# EAGLE design denmark (EAGLE 9.6.1)

## Sheet 1 of 2
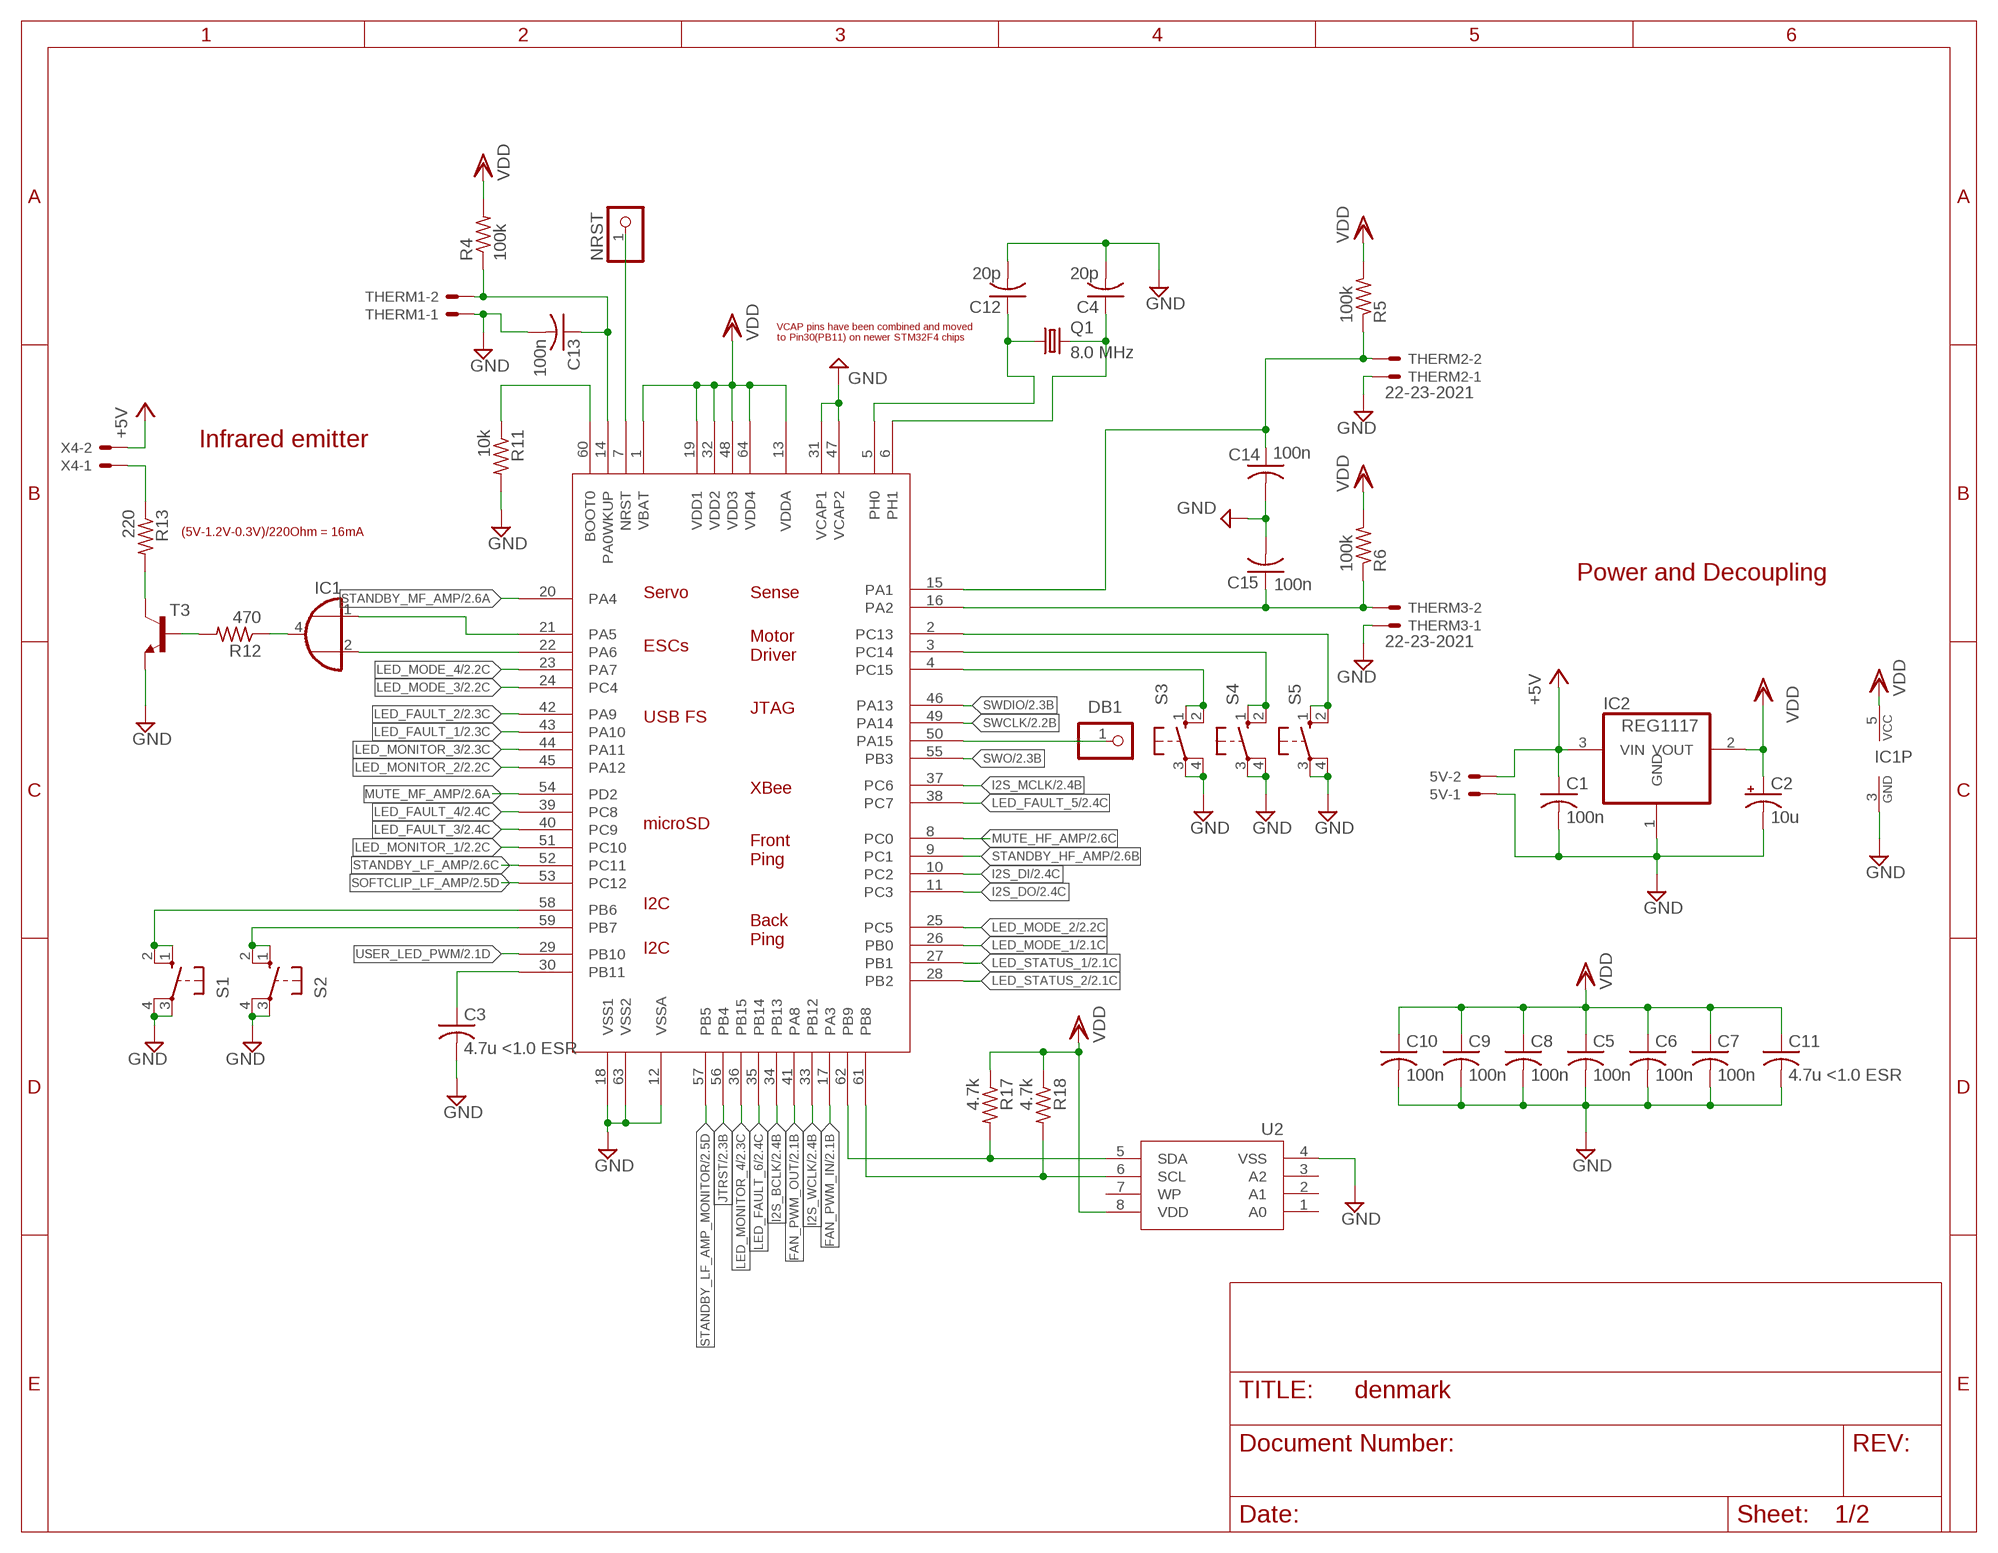
[diagram p0: schematic, sheet 1]

### Parts
5V  22-23-2021  [22-23-2021]
C1  100n  C-USC0805  [C0805]
C2  10u  CPOL-USE3.5-8  [E3,5-8]
C3  4.7u <1.0 ESR  C-USC1206  [C1206]
C4  20p  C-USC0603K  [C0603K]
C5  100n  C-USC0603K  [C0603K]
C6  100n  C-USC0603K  [C0603K]
C7  100n  C-USC0603K  [C0603K]
C8  100n  C-USC0603K  [C0603K]
C9  100n  C-USC0603K  [C0603K]
C10  100n  C-USC0603K  [C0603K]
C11  4.7u <1.0 ESR  C-USC1206  [C1206]
C12  20p  C-USC0603K  [C0603K]
C13  100n  C-USC0603K  [C0603K]
C14  100n  C-USC0603K  [C0603K]
C15  100n  C-USC0603K  [C0603K]
DB1  PINHD-1X1  [1X01]
IC1  74AHC1G32DBV  [SOT23-5]
IC2  REG1117  [SOT223]
NRST  PINHD-1X1  [1X01]
Q1  8.0 MHz  CRYSTALHC49U-V  [HC49U-V]
R4  100k  R-US_R0603  [R0603]
R5  100k  R-US_R0603  [R0603]
R6  100k  R-US_R0603  [R0603]
R11  10k  R-US_R0603  [R0603]
R12  470  R-US_R0603  [R0603]
R13  220  R-US_R0603  [R0603]
R17  4.7k  R-US_R0603  [R0603]
R18  4.7k  R-US_R0603  [R0603]
S1  10-XX  [B3F-10XX]
S2  10-XX  [B3F-10XX]
S3  10-XX  [B3F-10XX]
S4  10-XX  [B3F-10XX]
S5  10-XX  [B3F-10XX]
T3  MMBT3904LT1-NPN-SOT23-BEC  [SOT23-BEC]
THERM1  22-23-2021  [22-23-2021]
THERM2  22-23-2021  [22-23-2021]
THERM3  22-23-2021  [22-23-2021]
U1  STM32F4_10X10_LQFP64  [LQFP-ST-64-2]
U2  MB85RCSOIC8  [SOIC8]
X4  22-23-2021  [22-23-2021]

### Nets
+5V: 5V.2 C1.1 IC2.3(VIN) X4.2 ; also sheet 2
BUTTON1_INPUT: S1.1(S) S1.2(S1) U1.58(PB6)
BUTTON2_INPUT: S2.1(S) S2.2(S1) U1.59(PB7)
BUTTON3_INPUT: S3.1(S) S3.2(S1) U1.4(PC15)
BUTTON4_INPUT: S4.1(S) S4.2(S1) U1.3(PC14)
BUTTON5_INPUT: S5.1(S) S5.2(S1) U1.2(PC13)
FAN_PWM_IN: U1.17(PA3) ; also sheet 2
FAN_PWM_OUT: U1.41(PA8) ; also sheet 2
GND: 5V.1 C1.2 C2.- C3.2 C4.2 C5.2 C6.2 C7.2 C8.2 C9.2 C10.2 C11.2 C12.2 C13.2 C14.2 C15.2 IC1.3(GND) IC2.1(GND) R11.2 S1.3(P) S1.4(P1) S2.3(P) S2.4(P1) S3.3(P) S3.4(P1) S4.3(P) S4.4(P1) S5.3(P) S5.4(P1) T3.E THERM1.1 THERM2.1 THERM3.1 U1.12(VSSA) U1.18(VSS1) U1.31(VCAP1) U1.47(VCAP2) U1.63(VSS2) U2.4(VSS) ; also sheet 2
I2C_SCL: R18.2 U1.61(PB8) U2.6(SCL)
I2C_SDA: R17.2 U1.62(PB9) U2.5(SDA)
I2S_BCLK: U1.34(PB13) ; also sheet 2
I2S_DI: U1.10(PC2) ; also sheet 2
I2S_DO: U1.11(PC3) ; also sheet 2
I2S_MCLK: U1.37(PC6) ; also sheet 2
I2S_WCLK: U1.33(PB12) ; also sheet 2
IR_BASE: R12.2 T3.B
IR_CARRIER_OUT: IC1.2(I1) U1.22(PA6)
IR_COLLECTOR: R13.2 T3.C
IR_SIGNAL_OUT: IC1.1(I0) U1.21(PA5)
JTRST: U1.56(PB4) ; also sheet 2
LED_FAULT_1: U1.43(PA10) ; also sheet 2
LED_FAULT_2: U1.42(PA9) ; also sheet 2
LED_FAULT_3: U1.40(PC9) ; also sheet 2
LED_FAULT_4: U1.39(PC8) ; also sheet 2
LED_FAULT_5: U1.38(PC7) ; also sheet 2
LED_FAULT_6: U1.35(PB14) ; also sheet 2
LED_MODE_1: U1.26(PB0) ; also sheet 2
LED_MODE_2: U1.25(PC5) ; also sheet 2
LED_MODE_3: U1.24(PC4) ; also sheet 2
LED_MODE_4: U1.23(PA7) ; also sheet 2
LED_MONITOR_1: U1.51(PC10) ; also sheet 2
LED_MONITOR_2: U1.45(PA12) ; also sheet 2
LED_MONITOR_3: U1.44(PA11) ; also sheet 2
LED_MONITOR_4: U1.36(PB15) ; also sheet 2
LED_STATUS_1: U1.27(PB1) ; also sheet 2
LED_STATUS_2: U1.28(PB2) ; also sheet 2
MUTE_HF_AMP: U1.8(PC0) ; also sheet 2
MUTE_MF_AMP: U1.54(PD2) ; also sheet 2
N$42: C3.1 U1.30(PB11)
N$43: DB1.1 U1.50(PA15)
N$45: R11.1 U1.60(BOOT0)
N$46: NRST.1 U1.7(NRST)
N$47: IC1.4(O) R12.1
N$50: R13.1 X4.1
RCC_OSC_IN: C12.1 Q1.1 U1.5(PH0)
RCC_OSC_OUT: C4.1 Q1.2 U1.6(PH1)
SOFTCLIP_LF_AMP: U1.53(PC12) ; also sheet 2
STANDBY_HF_AMP: U1.9(PC1) ; also sheet 2
STANDBY_LF_AMP: U1.52(PC11) ; also sheet 2
STANDBY_LF_AMP_MONITOR: U1.57(PB5) ; also sheet 2
STANDBY_MF_AMP: U1.20(PA4) ; also sheet 2
SWCLK: U1.49(PA14) ; also sheet 2
SWDIO: U1.46(PA13) ; also sheet 2
SWO: U1.55(PB3) ; also sheet 2
THERM1_ANALOG_INPUT: C13.1 R4.1 THERM1.2 U1.14(PA0WKUP)
THERM2_ANALOG_INPUT: C14.1 R5.1 THERM2.2 U1.15(PA1)
THERM3_ANALOG_INPUT: C15.1 R6.1 THERM3.2 U1.16(PA2)
USER_LED_PWM: U1.29(PB10) ; also sheet 2
VDD: C2.+ C5.1 C6.1 C7.1 C8.1 C9.1 C10.1 C11.1 IC1.5(VCC) IC2.2(VOUT) R4.2 R5.2 R6.2 R17.1 R18.1 U1.1(VBAT) U1.13(VDDA) U1.19(VDD1) U1.32(VDD2) U1.48(VDD3) U1.64(VDD4) U2.8(VDD) ; also sheet 2
Unconnected: U2.1(A0) U2.2(A1) U2.3(A2) U2.7(WP)

### Notes on the sheet
- VCAP pins have been combined and moved 
  to Pin30(PB11) on newer STM32F4 chips
- Infrared emitter
- (5V-1.2V-0.3V)/220Ohm = 16mA
- Power and Decoupling

## Sheet 2 of 2: Input/Output
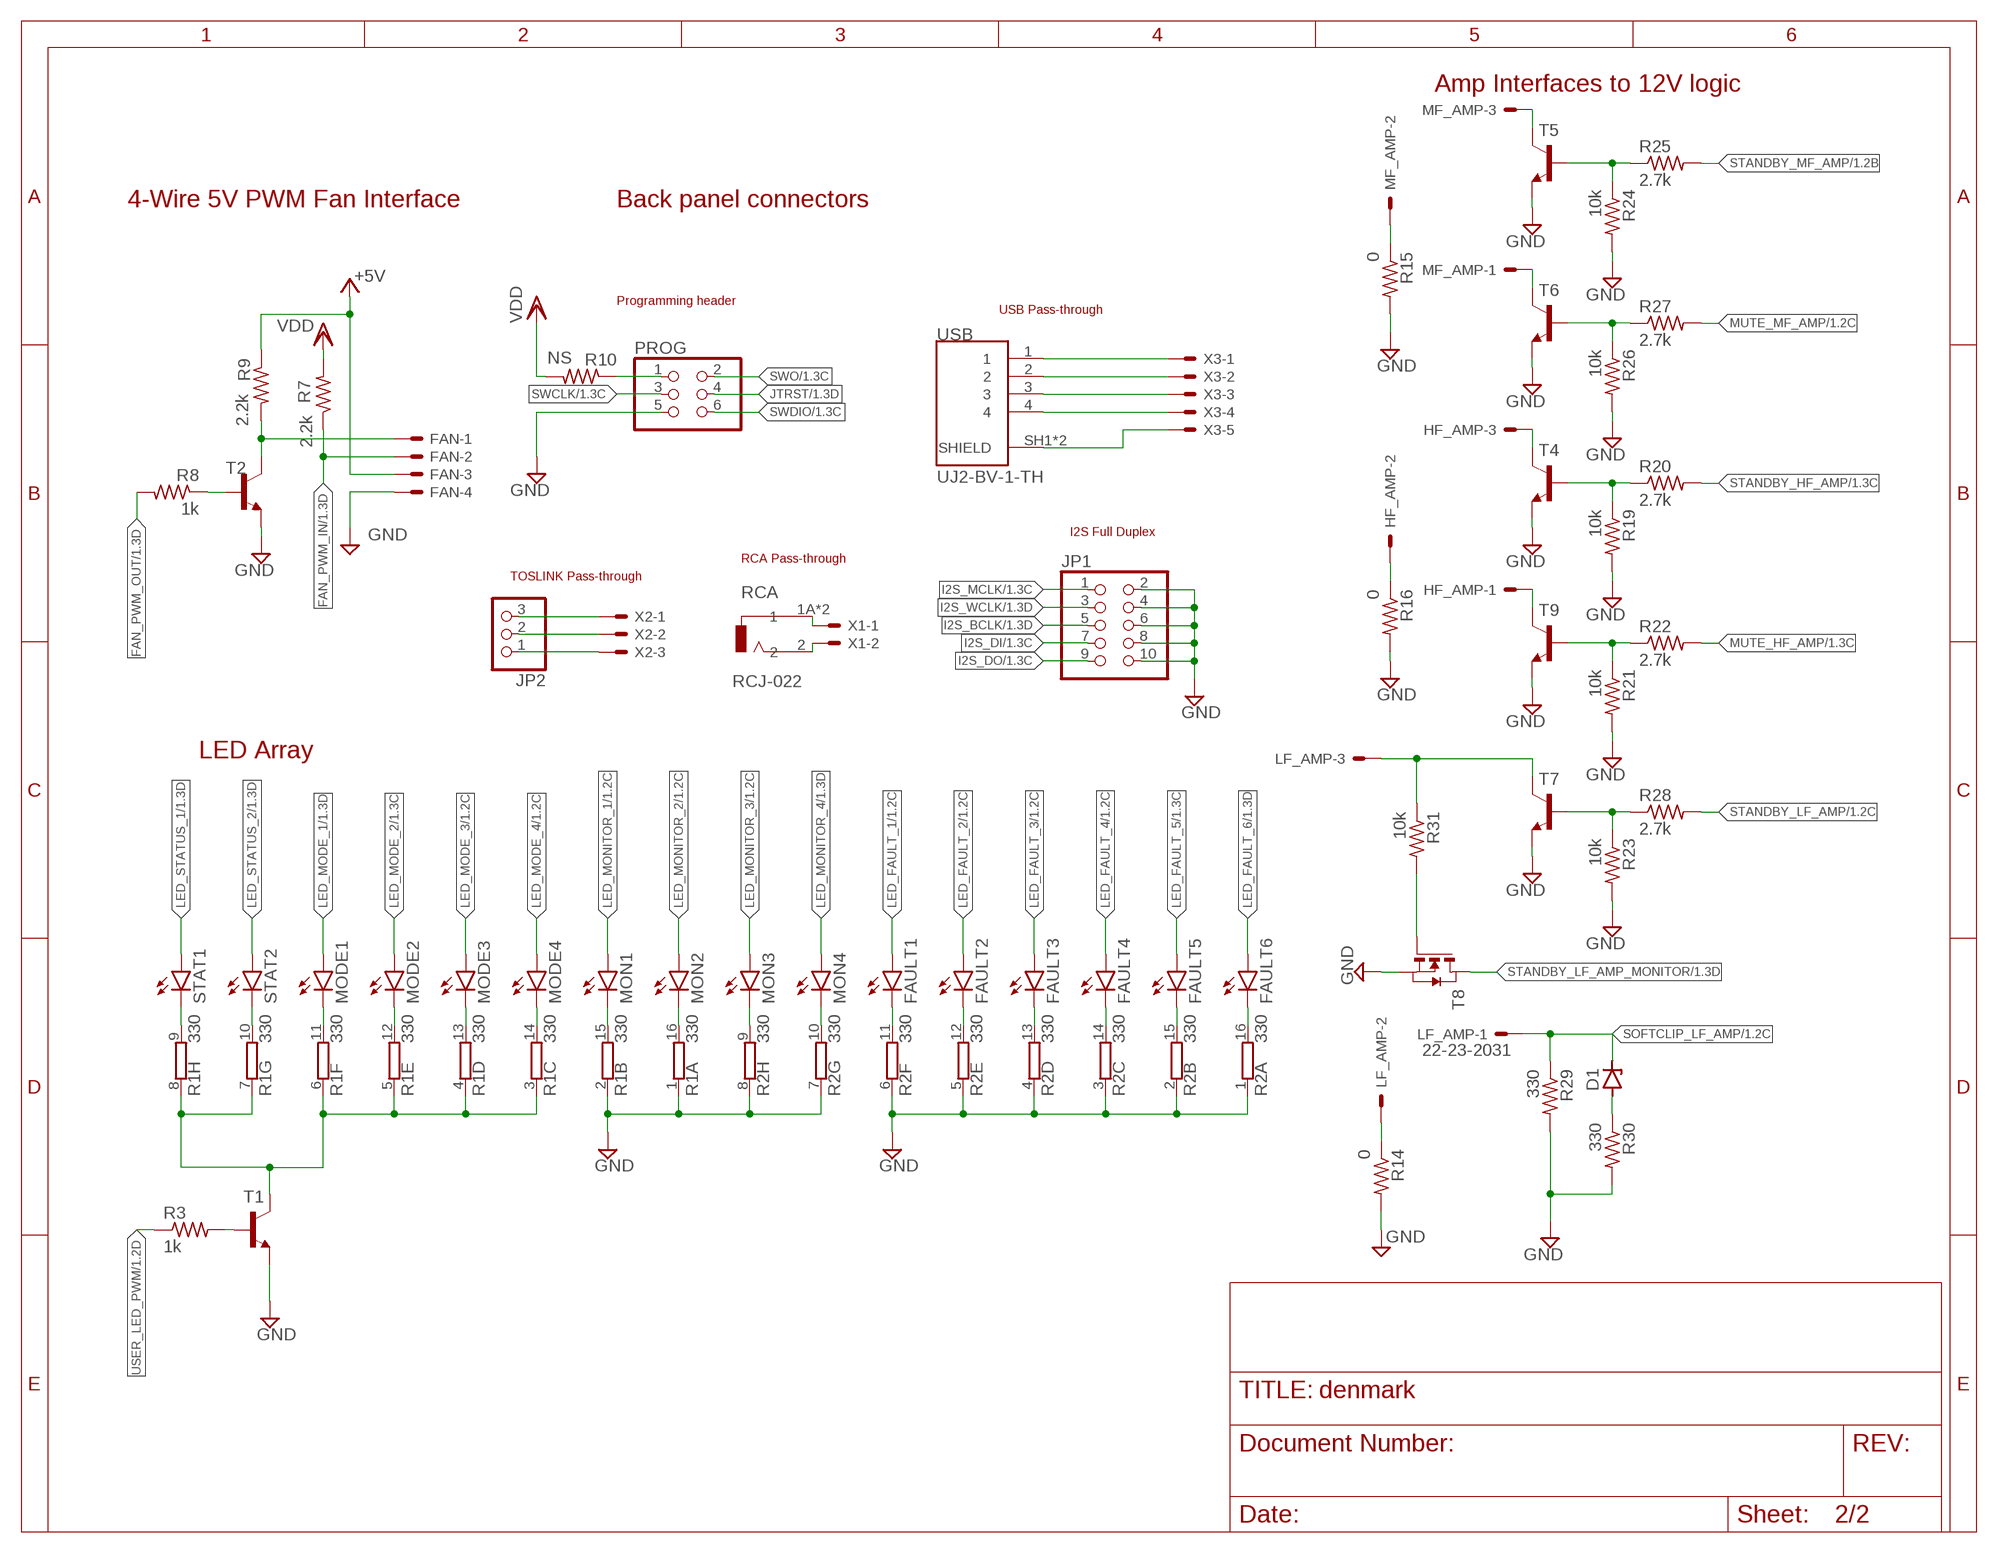
[diagram p1: schematic, sheet 2]

### Parts
D1  ZENER-DIODESOD80C  [SOD80C]
FAN  22-23-2041  [22-23-2041]
FAULT1  LEDCHIPLED_0805  [CHIPLED_0805]
FAULT2  LEDCHIPLED_0805  [CHIPLED_0805]
FAULT3  LEDCHIPLED_0805  [CHIPLED_0805]
FAULT4  LEDCHIPLED_0805  [CHIPLED_0805]
FAULT5  LEDCHIPLED_0805  [CHIPLED_0805]
FAULT6  LEDCHIPLED_0805  [CHIPLED_0805]
HF_AMP  22-23-2031  [22-23-2031]
JP1  PINHD-2X5  [2X05]
JP2  PINHD-1X3  [1X03]
LF_AMP  22-23-2031  [22-23-2031]
MF_AMP  22-23-2031  [22-23-2031]
MODE1  LEDCHIPLED_0805  [CHIPLED_0805]
MODE2  LEDCHIPLED_0805  [CHIPLED_0805]
MODE3  LEDCHIPLED_0805  [CHIPLED_0805]
MODE4  LEDCHIPLED_0805  [CHIPLED_0805]
MON1  LEDCHIPLED_0805  [CHIPLED_0805]
MON2  LEDCHIPLED_0805  [CHIPLED_0805]
MON3  LEDCHIPLED_0805  [CHIPLED_0805]
MON4  LEDCHIPLED_0805  [CHIPLED_0805]
PROG  PINHD-2X3  [2X03]
R1  330  2NBS16-8E  [SO16]
R2  330  2NBS16-8E  [SO16]
R3  1k  R-US_R0603  [R0603]
R7  2.2k  R-US_R0603  [R0603]
R8  1k  R-US_R0603  [R0603]
R9  2.2k  R-US_R0603  [R0603]
R10  NS  R-US_R0603  [R0603]
R14  0  R-US_R0603  [R0603]
R15  0  R-US_R0603  [R0603]
R16  0  R-US_R0603  [R0603]
R19  10k  R-US_R0603  [R0603]
R20  2.7k  R-US_R0603  [R0603]
R21  10k  R-US_R0603  [R0603]
R22  2.7k  R-US_R0603  [R0603]
R23  10k  R-US_R0603  [R0603]
R24  10k  R-US_R0603  [R0603]
R25  2.7k  R-US_R0603  [R0603]
R26  10k  R-US_R0603  [R0603]
R27  2.7k  R-US_R0603  [R0603]
R28  2.7k  R-US_R0603  [R0603]
R29  330  R-US_R0603  [R0603]
R30  330  R-US_R0603  [R0603]
R31  10k  R-US_R0603  [R0603]
RCA  RCJ-022  [CUI_RCJ-022]
STAT1  LEDCHIPLED_0805  [CHIPLED_0805]
STAT2  LEDCHIPLED_0805  [CHIPLED_0805]
T1  MMBT3904LT1-NPN-SOT23-BEC  [SOT23-BEC]
T2  MMBT3904LT1-NPN-SOT23-BEC  [SOT23-BEC]
T4  MMBT3904LT1-NPN-SOT23-BEC  [SOT23-BEC]
T5  MMBT3904LT1-NPN-SOT23-BEC  [SOT23-BEC]
T6  MMBT3904LT1-NPN-SOT23-BEC  [SOT23-BEC]
T7  MMBT3904LT1-NPN-SOT23-BEC  [SOT23-BEC]
T8  NMOSSOT23  [SOT-23]
T9  MMBT3904LT1-NPN-SOT23-BEC  [SOT23-BEC]
USB  UJ2-BV-1-TH  [CUI_UJ2-BV-1-TH]
X1  22-23-2021  [22-23-2021]
X2  22-23-2031  [22-23-2031]
X3  22-23-2051  [22-23-2051]

### Nets
+5V: FAN.3 R9.1 ; also sheet 1
FAN_PWM_IN: FAN.2 R7.1 ; also sheet 1
FAN_PWM_OUT: R8.2 ; also sheet 1
GND: FAN.4 JP1.2 JP1.4 JP1.6 JP1.8 JP1.10 PROG.5 R1.1 R1.2 R2.1 R2.2 R2.3 R2.4 R2.5 R2.6 R2.7 R2.8 R14.2 R15.2 R16.2 R19.2 R21.2 R23.2 R24.2 R26.2 R29.2 R30.2 T1.E T2.E T4.E T5.E T6.E T7.E T8.2(S) T9.E ; also sheet 1
I2S_BCLK: JP1.5 ; also sheet 1
I2S_DI: JP1.7 ; also sheet 1
I2S_DO: JP1.9 ; also sheet 1
I2S_MCLK: JP1.1 ; also sheet 1
I2S_WCLK: JP1.3 ; also sheet 1
JTRST: PROG.4 ; also sheet 1
LED_FAULT_1: FAULT1.A ; also sheet 1
LED_FAULT_2: FAULT2.A ; also sheet 1
LED_FAULT_3: FAULT3.A ; also sheet 1
LED_FAULT_4: FAULT4.A ; also sheet 1
LED_FAULT_5: FAULT5.A ; also sheet 1
LED_FAULT_6: FAULT6.A ; also sheet 1
LED_MODE_1: MODE1.A ; also sheet 1
LED_MODE_2: MODE2.A ; also sheet 1
LED_MODE_3: MODE3.A ; also sheet 1
LED_MODE_4: MODE4.A ; also sheet 1
LED_MONITOR_1: MON1.A ; also sheet 1
LED_MONITOR_2: MON2.A ; also sheet 1
LED_MONITOR_3: MON3.A ; also sheet 1
LED_MONITOR_4: MON4.A ; also sheet 1
LED_STATUS_1: STAT1.A ; also sheet 1
LED_STATUS_2: STAT2.A ; also sheet 1
LED_USER_ANODE: R1.3 R1.4 R1.5 R1.6 R1.7 R1.8 T1.C
MUTE_HF_AMP: R22.2 ; also sheet 1
MUTE_MF_AMP: R27.2 ; also sheet 1
N$1: R1.9 STAT1.C
N$2: R1.10 STAT2.C
N$3: MODE1.C R1.11
N$4: MODE2.C R1.12
N$5: MODE3.C R1.13
N$6: MODE4.C R1.14
N$7: MON1.C R1.15
N$8: MON2.C R1.16
N$9: MON3.C R2.9
N$10: MON4.C R2.10
N$11: FAULT1.C R2.11
N$12: FAULT2.C R2.12
N$13: FAULT3.C R2.13
N$14: FAULT4.C R2.14
N$15: FAULT5.C R2.15
N$16: FAULT6.C R2.16
N$17: R3.2 T1.B
N$18: HF_AMP.3 T4.C
N$19: R19.1 R20.1 T4.B
N$20: HF_AMP.1 T9.C
N$21: R21.1 R22.1 T9.B
N$22: LF_AMP.3 R31.1 T7.C
N$23: MF_AMP.3 T5.C
N$24: R24.1 R25.1 T5.B
N$25: FAN.1 R9.2 T2.C
N$26: R8.1 T2.B
N$27: MF_AMP.1 T6.C
N$28: R26.1 R27.1 T6.B
N$29: R23.1 R28.1 T7.B
N$30: RCA.1A RCA.1B X1.1
N$31: RCA.2 X1.2
N$32: JP2.3 X2.1
N$33: JP2.2 X2.2
N$34: JP2.1 X2.3
N$35: R31.2 T8.3(G)
N$36: USB.1 X3.1
N$37: USB.2 X3.2
N$38: USB.3 X3.3
N$39: USB.4 X3.4
N$40: USB.SH1(SHIELD) USB.SH2(SHIELD) X3.5
N$41: D1.A R30.1
N$52: LF_AMP.2 R14.1
N$54: MF_AMP.2 R15.1
N$58: HF_AMP.2 R16.1
SOFTCLIP_LF_AMP: D1.C LF_AMP.1 R29.1 ; also sheet 1
ST_VDD: PROG.1 R10.1
STANDBY_HF_AMP: R20.2 ; also sheet 1
STANDBY_LF_AMP: R28.2 ; also sheet 1
STANDBY_LF_AMP_MONITOR: T8.1(D) ; also sheet 1
STANDBY_MF_AMP: R25.2 ; also sheet 1
SWCLK: PROG.3 ; also sheet 1
SWDIO: PROG.6 ; also sheet 1
SWO: PROG.2 ; also sheet 1
USER_LED_PWM: R3.1 ; also sheet 1
VDD: R7.2 R10.2 ; also sheet 1

### Notes on the sheet
- Amp Interfaces to 12V logic
- 4-Wire 5V PWM Fan Interface | Back panel connectors
- Programming header
- USB Pass-through
- I2S Full Duplex
- RCA Pass-through
- TOSLINK Pass-through
- LED Array

## Library data of the parts
5V THERM1-THERM3 X1 X4 = con-molex:22-23-2021: .100" (2.54mm) Center Header - 2 Pin; MF: MOLEX; MPN: 22-23-2021; OC_FARNELL: 1462926; OC_NEWARK: 25C3832
C1 C3-C15 = rcl:C-US: CAPACITOR, American symbol; SPICEPREFIX: C
C2 = rcl:CPOL-US: POLARIZED CAPACITOR, American symbol; SPICEPREFIX: C
D1 = diode:ZENER-DIODE: Z-Diode
DB1 NRST = pinhead:PINHD-1X1: PIN HEADER
FAN = con-molex:22-23-2041: .100" (2.54mm) Center Header - 4 Pin; MF: MOLEX; MPN: 22-23-2041; OC_FARNELL: 1462920; OC_NEWARK: 38C0355
FAULT1-FAULT6 MODE1-MODE4 MON1-MON4 STAT1 STAT2 = led:LED: LED OSRAM: - CHIPLED LG R971, LG N971, LY N971, LG Q971, LY Q971, LO R971, LY R971 LH N974, LH R974 LS Q976, LO Q976, LY Q976 LO Q996 - Hyper CHIPLED LW Q18S LB Q993, LB Q99A, LB R99A - SideLED LS A670, LO A670, LY A670, LG A670, LP A670 LB A673, LV A673, LT A673, LW A673 LH A674 LY A675 LS A676, LA A676, LO A676, LY A676, LW A676 LS A679, LY A679, LG A679 - Hyper Micro SIDELED® LS Y876, LA Y876, LO Y876, LY Y876 LT Y87S - SmartLED LW L88C, LW L88S LB L89C, LB L89S, LG L890 LS L89K, LO L89K, LY L89K LS L896, LA L896, LO L896, LY L896 - TOPLED LS T670, LO T670, LY T670, LG T670, LP T670 LSG T670, LSP T670, LSY T670, LOP T670, LYG T670 LG T671, LOG T671, LSG T671 LB T673, LV T673, LT T673, LW T673 LH T674 LS T676, LA T676, LO T676, LY T676, LB T676, LH T676, LSB T676, LW T676 LB T67C, LV T67C, LT T67C, LS T67K, LO T67K, LY T67K, LW E67C LS E67B, LA E67B, LO E67B, LY E67B, LB E67C, LV E67C, LT E67C LW T67C LS T679, LY T679, LG T679 LS T770, LO T770, LY T770, LG T770, LP T770 LB T773, LV T773, LT T773, LW T773 LH T774 LS E675, LA E675, LY E675, LS T675 LS T776, LA T776, LO T776, LY T776, LB T776 LHGB T686 LT T68C, LB T68C - Hyper Mini TOPLED® LB M676 - Mini TOPLED Santana® LG M470 LS M47K, LO M47K, LY M47K Source: http://www.osram.convergy.de LUXEON: - LUMILED® LXK2-PW12-R00, LXK2-PW12-S00, LXK2-PW14-U00, LXK2-PW14-V00 LXK2-PM12-R00, LXK2-PM12-S00, LXK2-PM14-U00 LXK2-PE12-Q00, LXK2-PE12-R00, LXK2-PE12-S00, LXK2-PE14-T00, LXK2-PE14-U00 LXK2-PB12-K00, LXK2-PB12-L00, LXK2-PB12-M00, LXK2-PB14-N00, LXK2-PB14-P00, LXK2-PB14-Q00 LXK2-PR12-L00, LXK2-PR12-M00, LXK2-PR14-Q00, LXK2-PR14-R00 LXK2-PD12-Q00, LXK2-PD12-R00, LXK2-PD12-S00 LXK2-PH12-R00, LXK2-PH12-S00 LXK2-PL12-P00, LXK2-PL12-Q00, LXK2-PL12-R00 Source: www.luxeon.com KINGBRIGHT: KA-3528ASYC Source: www.kingbright.com
HF_AMP LF_AMP MF_AMP X2 = con-molex:22-23-2031: .100" (2.54mm) Center Header - 3 Pin; MF: MOLEX; MPN: 22-23-2031; OC_FARNELL: 1462950; OC_NEWARK: 30C0862
IC1 = 74xx-little-de:74*1G32: 2-input OR gate
IC2 = burr-brown:REG1117: 800mA and 1A Low Dropout (LDO) Positive Regulator 1.8V, 2.5V, 2.85V, 3.3V, 5V, and Adj; MPN: REG1117; OC_FARNELL: 1097566; OC_NEWARK: 14P6981
JP1 = pinhead:PINHD-2X5: PIN HEADER
JP2 = pinhead:PINHD-1X3: PIN HEADER
PROG = pinhead:PINHD-2X3: PIN HEADER
Q1 = crystal:CRYSTAL: CRYSTAL; OC_FARNELL: 1666969; OC_NEWARK: unknown
R1 R2 = resistor-bourns:2NBS16-8E: BOURNS RESISTOR NETWORK; OC_FARNELL: unknown; OC_NEWARK: unknown
R3-R31 = rcl:R-US_: RESISTOR, American symbol; SPICEPREFIX: R
RCA = RCJ-022:RCJ-022: Metal Vertical RCA Jack, Red Insulator; MANUFACTURER: CUI Inc; PART_REV: B; STANDARD: Manufacturer recommendations
S1-S5 = switch-omron:10-XX: OMRON SWITCH; MPN: B3F-1000; OC_FARNELL: 176432; OC_NEWARK: 36M3542
T1-T7 T9 = transistor:*-NPN-: NPN Transistror BF959 corrected 2008.03.06
T8 = zetex:NMOSSOT23: MOS FET; OC_FARNELL: unknown; OC_NEWARK: unknown
U1 = stm32f4:STM32F4_10X10_LQFP64
U2 = eric_sorensen:MB85RC
USB = UJ2-BV-1-TH:UJ2-BV-1-TH: Type B, USB 2.0, 1 A, Vertical, Through Hole, USB Receptacle; MANUFACTURER: CUI INC; PART_REV: 1.0; STANDARD: MANUFACTURER RECOMMENDATIONS
X3 = con-molex:22-23-2051: .100" (2.54mm) Center Header - 5 Pin; MF: MOLEX; MPN: 22-23-2051; OC_FARNELL: 1462952; OC_NEWARK: 38C9178

## Board
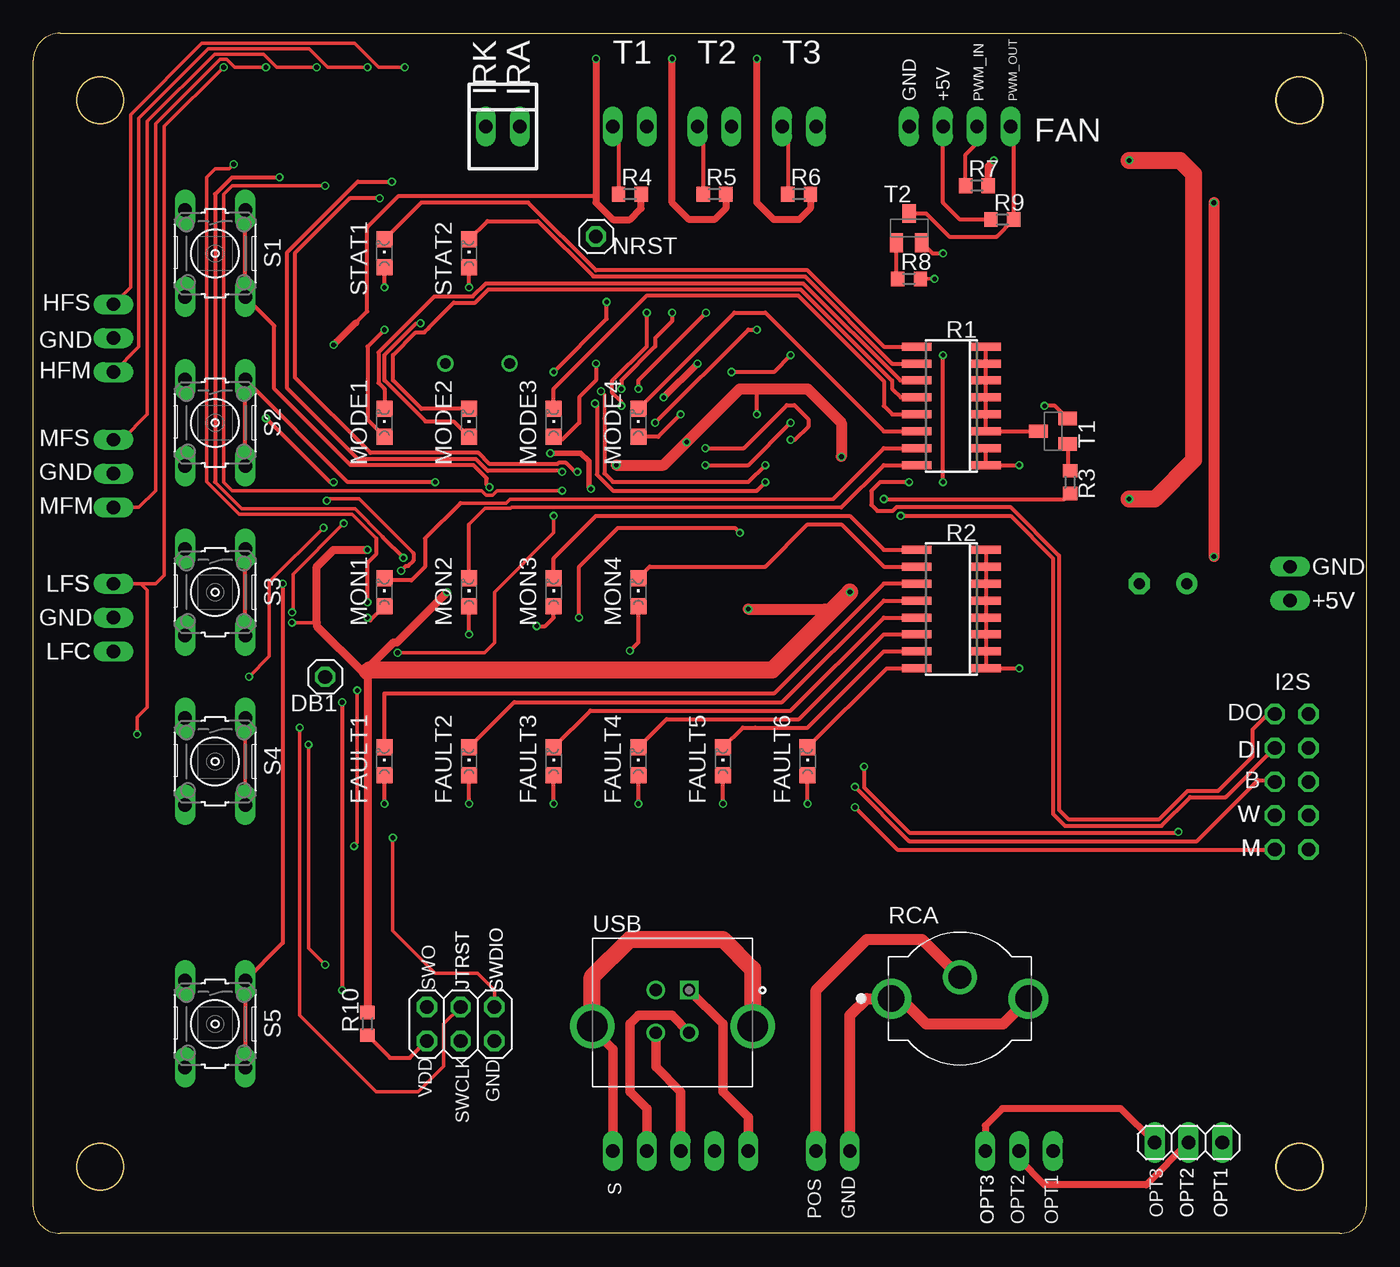
[diagram p2: board, top side]
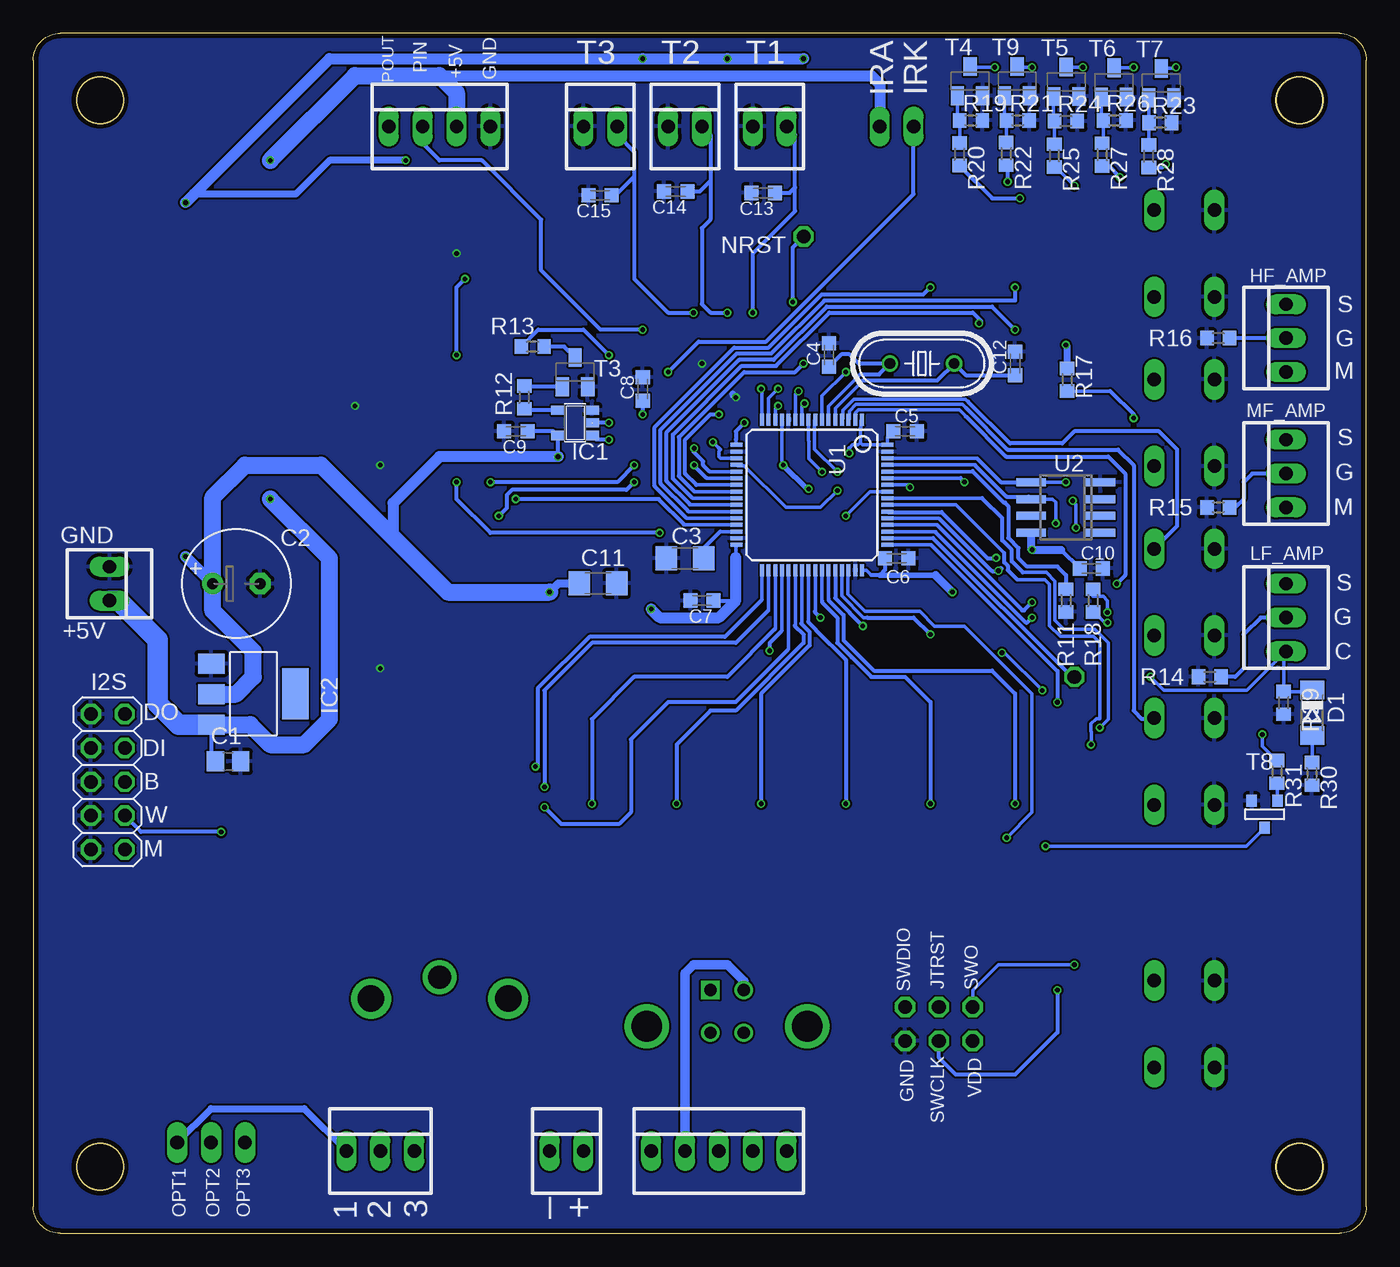
[diagram p3: board, bottom side, seen from below]

Size 100 x 90 mm. Coordinates in mm from the lower left corner, seen from the top.
Outline: 100,88 arc90 98,90 2,90 arc90 0,88 0,2 arc90 2,0 98,0 arc90 100,2 100,88
Outline: circle at 5,85 radius 1.75
Outline: circle at 95,5 radius 1.75
Outline: circle at 5,5 radius 1.75
Outline: circle at 95,85 radius 1.75
Copper layers (1*16): Top 0.035559375mm / dielectric 1.6mm / Bottom 0.035559375mm
Design rules "oshpark-2layer": minimum track width 6mil, minimum drill 10mil, track to track 6mil, track to pad 6mil, pad to pad 6mil, via to via 6mil, smd to smd 6mil, copper to edge 15mil, drill to drill 6mil, minimum pad ring 5mil, minimum via ring 5mil, stop-mask expansion 2.5mil, vias tented up to drill 0mil, thermal gap 10mil
Holes 3.5 mm at 5,85 95,85 95,4.99 5,4.99

### Footprints (pad centres in the part's own frame; a part is rotated, then mirrored left to right if it is on the bottom)
22-23-2021 = drill 1 long: 1 -1.27,0; 2 1.27,0
C0805 = smd 1.3 x 1.5: 1 -0.95,0; 2 0.95,0
E3,5-8 = drill 0.813 pad 1.6: + -1.778,0 | drill 0.813 pad 1.6 octagon: - 1.778,0
C1206 = smd 1.6 x 1.8: 1 -1.4,0; 2 1.4,0
C0603K = smd 1.05 x 1.08: 1 -0.875,0; 2 0.875,0
SOD80C = smd 1.4 x 1.8: A 1.7,0; C -1.7,0
1X01 = drill 1.016 octagon: 1 0,0
22-23-2041 = drill 1 long: 1 -3.81,0; 2 -1.27,0; 3 1.27,0; 4 3.81,0
CHIPLED_0805 = smd 1.2 x 1.2: A 0,-1.05; C 0,1.05
22-23-2031 = drill 1 long: 1 -2.54,0; 2 0,0; 3 2.54,0
SOT23-5 = smd 0.69 x 0.99: 1 -0.95,-1.29; 2 0,-1.29; 3 0.95,-1.29; 4 0.95,1.3; 5 -0.95,1.3
SOT223 = smd 1.499 x 2.007: 1 -2.261,-3.15; 2 0.025,-3.15; 3 2.311,-3.15 | smd 3.81 x 2.007: 4 0,3.15
2X05 = drill 1.016 octagon: 1 -5.08,-1.27; 2 -5.08,1.27; 3 -2.54,-1.27; 4 -2.54,1.27; 5 0,-1.27; 6 0,1.27; 7 2.54,-1.27; 8 2.54,1.27; 9 5.08,-1.27; 10 5.08,1.27
1X03 = drill 1.016 long: 1 -2.54,0; 2 0,0; 3 2.54,0
2X03 = drill 1.016 octagon: 1 -2.54,-1.27; 2 -2.54,1.27; 3 0,-1.27; 4 0,1.27; 5 2.54,-1.27; 6 2.54,1.27
HC49U-V = drill 0.813: 1 -2.413,0; 2 2.413,0
SO16 = smd 0.6 x 2.2: 1 -4.445,-2.6; 2 -3.175,-2.6; 3 -1.905,-2.6; 4 -0.635,-2.6; 5 0.635,-2.6; 6 1.905,-2.6; 7 3.175,-2.6; 8 4.445,-2.6; 9 4.445,2.6; 10 3.175,2.6; 11 1.905,2.6; 12 0.635,2.6; 13 -0.635,2.6; 14 -1.905,2.6; 15 -3.175,2.6; 16 -4.445,2.6
R0603 = smd 1 x 1.1: 1 -0.85,0; 2 0.85,0
CUI_RCJ-022 = drill 2: 1A -5.15,0; 1B 5.15,0 | drill 1.7: 2 0,1.6
B3F-10XX = drill 1.016 long: 1 -3.251,2.261; 2 3.251,2.261; 3 -3.251,-2.261; 4 3.251,-2.261
SOT23-BEC = smd 1 x 1.4: B -0.95,-1.1; C 0,1.1; E 0.95,-1.1
SOT-23 = smd 0.787 x 0.889: 1 0.025,-1.016; 2 -0.94,1.016; 3 0.991,1.016
LQFP-ST-64-2 = smd 0.9 x 0.3: 1 -5.65,3.75; 2 -5.65,3.25; 3 -5.65,2.75; 4 -5.65,2.25; 5 -5.65,1.75; 6 -5.65,1.25; 7 -5.65,0.75; 8 -5.65,0.25; 9 -5.65,-0.25; 10 -5.65,-0.75; 11 -5.65,-1.25; 12 -5.65,-1.75; 13 -5.65,-2.25; 14 -5.65,-2.75; 15 -5.65,-3.25; 16 -5.65,-3.75; 33 5.65,-3.75; 34 5.65,-3.25; 35 5.65,-2.75; 36 5.65,-2.25; 37 5.65,-1.75; 38 5.65,-1.25; 39 5.65,-0.75; 40 5.65,-0.25; 41 5.65,0.25; 42 5.65,0.75; 43 5.65,1.25; 44 5.65,1.75; 45 5.65,2.25; 46 5.65,2.75; 47 5.65,3.25; 48 5.65,3.75 | smd 0.3 x 0.9: 17 -3.75,-5.65; 18 -3.25,-5.65; 19 -2.75,-5.65; 20 -2.25,-5.65; 21 -1.75,-5.65; 22 -1.25,-5.65; 23 -0.75,-5.65; 24 -0.25,-5.65; 25 0.25,-5.65; 26 0.75,-5.65; 27 1.25,-5.65; 28 1.75,-5.65; 29 2.25,-5.65; 30 2.75,-5.65; 31 3.25,-5.65; 32 3.75,-5.65; 49 3.75,5.65; 50 3.25,5.65; 51 2.75,5.65; 52 2.25,5.65; 53 1.75,5.65; 54 1.25,5.65; 55 0.75,5.65; 56 0.25,5.65; 57 -0.25,5.65; 58 -0.75,5.65; 59 -1.25,5.65; 60 -1.75,5.65; 61 -2.25,5.65; 62 -2.75,5.65; 63 -3.25,5.65; 64 -3.75,5.65
SOIC8 = smd 0.6 x 2.2: 1 -1.905,-2.6; 2 -0.635,-2.6; 3 0.635,-2.6; 4 1.905,-2.6; 5 1.905,2.6; 6 0.635,2.6; 7 -0.635,2.6; 8 -1.905,2.6
CUI_UJ2-BV-1-TH = drill 0.92 square: 1 0,0 | drill 0.92: 2 -2.5,0; 3 -2.5,-3.2; 4 0,-3.2 | drill 2.3: SH1 -7.27,-2.71; SH2 4.77,-2.71
22-23-2051 = drill 1 long: 1 -5.08,0; 2 -2.54,0; 3 0,0; 4 2.54,0; 5 5.08,0

### Placement (x,y rotation side)
5V  94.28,48.73 270 bottom
C1  85.39,35.39 0 bottom
C2  84.76,48.73 0 bottom
C3  51.1,50.63 180 bottom
C4  40.31,65.87 90 bottom
C5  34.59,60.16 0 bottom
C6  35.23,50.63 0 bottom
C7  49.84,47.45 180 bottom
C8  54.28,63.33 90 bottom
C9  63.8,60.16 180 bottom
C10  20.62,49.87 0 bottom
C11  57.63,48.75 0 bottom
C12  26.34,65.23 90 bottom
C13  45.24,78.04 180 bottom
C14  51.79,78.14 180 bottom
C15  57.48,77.86 180 bottom
D1  4.04,39.05 270 bottom
DB1  21.89,41.74 0 top
FAN  69.52,83.02 0 bottom
FAULT1  26.34,35.39 0 top
FAULT2  32.69,35.39 0 top
FAULT3  39.04,35.39 0 top
FAULT4  45.39,35.39 0 top
FAULT5  51.74,35.39 0 top
FAULT6  58.09,35.39 0 top
HF_AMP  6.02,67.14 90 bottom
IC1  59.36,60.79 90 bottom
IC2  83.49,40.47 270 bottom
JP1  94.41,33.87 90 bottom
JP2  86.66,6.81 0 top
LF_AMP  6.02,46.19 90 bottom
MF_AMP  6.02,56.98 90 bottom
MODE1  26.34,60.79 0 top
MODE2  32.69,60.79 0 top
MODE3  39.04,60.79 0 top
MODE4  45.39,60.79 0 top
MON1  26.34,48.09 0 top
MON2  32.69,48.09 0 top
MON3  39.04,48.09 0 top
MON4  45.39,48.09 0 top
NRST  42.22,74.76 0 top
PROG  32.06,15.7 0 top
Q1  33.33,65.23 180 bottom
R1  68.89,62.06 90 top
R2  68.89,46.82 90 top
R3  77.78,56.34 90 top
R4  44.76,77.94 0 top
R5  51.1,77.94 0 top
R6  57.45,77.94 0 top
R7  70.79,78.57 0 top
R8  65.71,71.59 0 top
R9  72.69,76.03 0 top
R10  25.07,15.7 90 top
R11  22.53,47.45 270 bottom
R12  63.17,62.7 90 bottom
R13  62.53,66.5 0 bottom
R14  11.73,41.74 180 bottom
R15  11.1,54.44 180 bottom
R16  11.1,67.14 180 bottom
R17  22.44,64.03 270 bottom
R18  20.5,47.45 90 bottom
R19  29.64,83.47 0 bottom
R20  30.51,80.93 270 bottom
R21  26.14,83.47 0 bottom
R22  27,80.96 270 bottom
R23  15.44,83.29 0 bottom
R24  22.53,83.42 0 bottom
R25  23.39,80.83 270 bottom
R26  18.87,83.47 0 bottom
R27  19.81,80.91 270 bottom
R28  16.31,80.78 270 bottom
R29  6.2,39.78 270 bottom
R30  4.06,34.45 270 bottom
R31  6.71,34.6 270 bottom
RCA  69.52,17.61 0 top
S1  13.64,73.49 270 top
S2  13.64,60.79 270 top
S3  13.64,48.09 270 top
S4  13.64,35.39 270 top
S5  13.64,15.7 270 top
STAT1  26.34,73.49 0 top
STAT2  32.69,73.49 0 top
T1  76.5,60.16 90 top
T2  65.71,75.39 0 top
T3  59.36,64.6 0 bottom
T4  29.72,86.42 0 bottom
T5  22.5,86.37 0 bottom
T6  18.92,86.32 0 bottom
T7  15.37,86.27 0 bottom
T8  7.65,31.43 0 bottom
T9  26.19,86.42 0 bottom
THERM1  44.76,83.02 0 bottom
THERM2  51.1,83.02 0 bottom
THERM3  57.45,83.02 0 bottom
U1  41.58,55.38 270 bottom
U2  22.53,54.44 90 bottom
USB  49.2,18.25 0 top
X1  59.99,6.18 0 bottom
X2  73.97,6.18 0 bottom
X3  48.56,6.18 0 bottom
X4  35.23,83.02 0 top

### Tracks (layer width: path | path; a pad name or v marks a point on that pad's centre or on a via)
+5V  (via drill 0.35)
  Top 0.305: R9.1 69.52,76.03 68.25,77.3 FAN.3
  Top 1.27: v82.22,80.47 86.03,80.47 87.05,79.46 87.05,58 84.12,55.08 v82.22,55.08
  Bottom 0.305: IC2.3 86.64,35.69 C1.1
  Bottom 0.813: 69.52,86.83 37.13,86.83 36.5,86.19 X4.2
  Bottom 1.27: IC2.3 83.72,38.16 82.22,36.66 79.68,36.66 77.78,38.56 77.78,50.63 v82.22,55.08 | v82.22,80.47 75.87,86.83 69.52,86.83 68.25,85.56 FAN.3
  Bottom 1.524: IC2.3 89.08,38.16 90.65,39.73 90.65,44.51 93.6,47.45 5V.2
BUTTON1_INPUT  (via drill 0.35)
  Top 0.305: v34.22,55.95 34.01,56.16 34.01,56.63 33.02,57.62 23.8,57.62 18.08,63.33 18.08,68.05 S1.2 S1.1
  Bottom 0.254: v34.22,55.95 34.39,56.13 U1.58
BUTTON2_INPUT  (via drill 0.35)
  Top 0.305: S2.2 S2.1 23.6,56.34 v30.15,56.34
  Bottom 0.254: U1.59 30.44,56.63
  Bottom 0.305: 30.44,56.63 v30.15,56.34
BUTTON3_INPUT
  Top 0.305: S3.2 S3.1
  Bottom 0.254: U1.4 39.26,61.1 39.26,61.75 38.43,62.57 30.05,62.57 29.86,62.38
  Bottom 0.305: 29.86,62.38 26.72,59.24 22.81,59.24 21.89,60.16 15.55,60.16 14.17,58.78 14.17,53.07 S3.1
BUTTON4_INPUT
  Top 0.254: S4.2 S4.1
  Bottom 0.254: S4.1 15.98,38.56 | U1.3 38.76,61.1 38.76,61.67 38.26,62.17 30.29,62.17 30.03,61.9
  Bottom 0.305: 30.03,61.9 26.91,58.78 18.63,58.78 17.45,57.6 17.45,39.2 16.81,38.56 15.98,38.56
BUTTON5_INPUT  (via drill 0.35)
  Top 0.305: v18.72,48.73 18.72,21.78 S5.1 S5.2
  Bottom 0.254: U1.2 38.31,61.05 38.31,61.55 38.1,61.76 30.53,61.76 30.05,61.28
  Bottom 0.305: v18.72,48.73 18.08,49.36 18.08,56.98 19.36,58.25 27.02,58.25 30.05,61.28
FAN_PWM_IN  (via drill 0.35)
  Top 0.305: v46.66,60.79 53.65,67.78 v54.28,67.78 | R7.1 69.94,80.89 70.79,81.75 FAN.2
  Bottom 0.254: 47.3,59.52 47.3,59.2 U1.17
  Bottom 0.305: 47.3,59.52 47.3,60.16 v46.66,60.79 | v54.28,67.78 57.45,67.78 61.9,72.22 61.9,76.03 66.34,80.47 69.52,80.47 70.79,81.75 FAN.2
FAN_PWM_OUT  (via drill 0.35)
  Top 0.254: v67.62,71.59 R8.2
  Top 0.305: v40.95,46.19 40.95,49.99 43.87,52.92 52.63,52.92 v53.01,52.53 | v68.25,56.34 v68.25,65.87
  Bottom 0.254: U1.41 41.33,46.67 41.38,46.62
  Bottom 0.305: 41.38,46.62 v40.95,46.19 | v67.62,71.59 68.25,70.95 v68.25,65.87 | v53.01,52.53 65.71,52.53 68.25,55.08 v68.25,56.34
GND  (via drill 0.35)
  Top 0.305: R2.8 R2.7 R2.6 R2.5 R2.4 R2.3 R2.2 R2.1 v73.97,42.38 | R1.2 R1.1 v73.97,57.62 | T1.E 76.65,62.06 v75.87,62.06 | T2.E 67.47,73.49 v68.25,73.49
  Top 0.508: v47.3,62.7 v49.84,65.23
  Bottom 0.508: v47.3,62.7 47.54,62.94
  pour Bottom: 0.31,90 0.31,-0.17 100,-0.17 100,90
I2C_SCL  (via drill 0.35)
  Top 0.254: v23.29,53.25 19.48,49.44 19.48,46.57 v19.42,46.57
  Bottom 0.254: U2.6 23.55,55.08 23.29,54.82 v23.29,53.25 | R18.2 20.5,47.77 19.74,47.77 19.42,47.45 v19.42,46.57 | U1.61 29.35,57.63 29.34,57.62
  Bottom 0.305: 29.34,57.62 26.98,55.25 25.31,55.25 U2.6
I2C_SDA  (via drill 0.35)
  Top 0.305: v17.45,61.15 22.25,56.34 v22.53,56.34
  Bottom 0.254: U2.5 v22.53,56.34 | R17.2 19.2,63.17 | U1.62 29.21,58.13 29.19,58.11
  Bottom 0.305: U2.5 27.42,56.34 29.19,58.11 | 19.2,63.17 17.45,61.42 v17.45,61.15
I2S_BCLK  (via drill 0.35)
  Top 0.305: v61.65,33.48 65.71,29.42 87.3,29.42 91.87,33.99 93.02,33.99 JP1.5
  Bottom 0.254: U1.34 44.83,46.74 44.88,46.7
  Bottom 0.305: 44.88,46.7 47.3,44.28 58.09,44.28 61.65,40.72 v61.65,33.48
I2S_DI  (via drill 0.35)
  Top 0.305: v42.14,62.24 42.29,62.09 42.29,56.9 43.48,55.71 54.28,55.71 v54.91,56.34 | v65.08,53.8 73.33,53.8 76.5,50.63 76.5,31.45 77.39,30.56 84.63,30.56 86.79,32.72 89.46,32.72 JP1.7
  Bottom 0.254: U1.10 42.33,62.05 v42.14,62.24
  Bottom 0.305: v54.91,56.34 55.5,55.76 64.09,55.76 64.49,55.36 64.49,54.39 v65.08,53.8
I2S_DO  (via drill 0.35)
  Top 0.254: 42.85,61.09 42.85,62.9 v42.6,63.15
  Top 0.305: v54.91,57.62 53.65,56.35 43.49,56.35 42.85,56.99 42.85,61.09 | JP1.9 92.63,38.95 91.49,37.8 91.49,35.77 88.9,33.18 86.6,33.18 84.49,31.07 77.65,31.07 76.96,31.76 76.96,50.82 73.29,54.49 64.79,54.49 64.49,54.19 63.32,54.19 62.87,54.64 62.87,55.69 63.53,56.34 v65.71,56.34
  Bottom 0.254: v42.6,63.15 42.83,62.92 U1.11
  Bottom 0.305: v54.91,57.62 56.19,56.34 v65.71,56.34
I2S_MCLK  (via drill 0.35)
  Top 0.305: v61.65,31.96 64.82,28.79 JP1.1
  Bottom 0.254: U1.37 43.33,43.81 43.42,43.72
  Bottom 0.305: 43.42,43.72 47.31,39.84 52.38,39.84 55.17,37.04 55.17,31.58 56.06,30.69 60.38,30.69 v61.65,31.96
I2S_WCLK  (via drill 0.35)
  Top 0.305: v62.33,35.01 62.33,33.45 65.72,30.06 85.9,30.06 v85.9,30.1
  Bottom 0.254: U1.33 45.33,47.52 45.38,47.47
  Bottom 0.305: 45.38,47.47 48.11,44.74 58.28,44.74 62.15,40.86 62.15,35.01 v62.33,35.01 | v85.9,30.1 91.92,30.1 JP1.3
IR_BASE
  Bottom 0.305: T3.B 63.12,63.5 R12.2
IR_CARRIER_OUT  (via drill 0.35)
  Top 0.305: v50.42,57.62 53.65,57.62 v56.82,60.79
  Bottom 0.254: U1.22 49.48,56.63 49.49,56.63
  Bottom 0.305: 49.49,56.63 50.47,57.62 v50.42,57.62 | v56.82,60.79 IC1.2
IR_COLLECTOR
  Bottom 0.305: T3.C 60.16,66.5 R13.2
IR_SIGNAL_OUT  (via drill 0.35)
  Top 0.305: v50.42,58.89 53.31,58.89 56.54,62.11 57.1,62.11 58.14,61.07 58.14,60.51 57.15,59.52 v56.82,59.52
  Bottom 0.254: U1.21 49.25,57.13 49.26,57.13
  Bottom 0.305: 49.26,57.13 49.74,57.62 49.74,57.9 50.47,58.63 50.47,58.89 v50.42,58.89 | v56.82,59.52 57.75,59.52 IC1.1
JTRST  (via drill 0.35)
  Top 0.254: v19.99,37.93 19.99,16.34 25.7,10.62 28.88,10.62 30.78,12.53 30.78,15.7 PROG.4
  Bottom 0.254: 25.76,49.56 24,49.56 23.36,48.92 23.36,45.99 22.67,45.3 20.37,45.3 19.36,44.28 19.36,38.56 v19.99,37.93 | U1.56 28.82,55.13 28.81,55.13
  Bottom 0.305: 25.76,49.56 26.59,50.4 26.59,51.25 27.31,51.97 27.31,53.63 28.81,55.13
LED_FAULT_1  (via drill 0.35)
  Top 0.305: v26.34,32.22 FAULT1.A
  Bottom 0.254: U1.43 40.33,47.59
  Bottom 0.305: v26.34,32.22 26.34,40.47 28.07,42.2 36.93,42.2 39.22,44.48 39.22,46.37 40.33,47.49 40.33,47.59
LED_FAULT_2  (via drill 0.35)
  Top 0.305: v32.69,32.22 FAULT2.A
  Bottom 0.254: U1.42 40.83,47.44
  Bottom 0.305: v32.69,32.22 32.69,39.84 34.59,41.74 37.13,41.74 38.58,43.19 38.58,43.2 39.67,44.29 39.67,46.19 40.83,47.34 40.83,47.44
LED_FAULT_3  (via drill 0.35)
  Top 0.305: v39.04,32.22 FAULT3.A
  Bottom 0.254: U1.40 41.83,45.92 41.88,45.87
  Bottom 0.305: 41.88,45.87 41.3,45.29 41.3,45.27 39.04,43.01 v39.04,32.22
LED_FAULT_4  (via drill 0.35)
  Top 0.305: v45.39,32.22 FAULT4.A
  Bottom 0.254: U1.39 42.33,45.78 42.38,45.73
  Bottom 0.305: 42.38,45.73 41.76,45.1 41.76,44.09 45.39,40.46 v45.39,32.22
LED_FAULT_5  (via drill 0.35)
  Top 0.305: v51.74,32.22 FAULT5.A
  Bottom 0.254: U1.38 42.83,45.63 42.88,45.58
  Bottom 0.305: 42.88,45.58 42.22,44.91 42.22,44.28 47.3,39.2 49.2,39.2 51.74,36.66 v51.74,32.22
LED_FAULT_6  (via drill 0.35)
  Top 0.305: v58.09,32.22 FAULT6.A
  Bottom 0.254: U1.35 44.33,45.34 44.38,45.29
  Bottom 0.305: v58.09,32.22 58.09,38.56 54.91,41.74 47.93,41.74 44.38,45.29
LED_MODE_1  (via drill 0.35)
  Top 0.305: v26.34,67.78 25.07,66.5 25.07,61.01 MODE1.A
  Bottom 0.254: U1.26 50.7,54.63 50.74,54.68
  Bottom 0.305: 50.74,54.68 52.48,56.41 52.48,60.09 47.05,65.51 44.45,65.51 40.47,69.5 28.07,69.5 v26.34,67.78
LED_MODE_2  (via drill 0.35)
  Top 0.305: v29.04,68.25 28.72,68.25 26.35,65.88 26.35,63.97 29.42,60.9 31.53,60.9 MODE2.A
  Bottom 0.254: U1.25 50.55,55.13 50.6,55.18
  Bottom 0.305: 50.6,55.18 52.02,56.6 52.02,59.9 46.86,65.06 44.26,65.06 40.27,69.05 29.52,69.05 28.88,68.41 v29.04,68.25
LED_MODE_3  (via drill 0.35)
  Top 0.305: v42.22,65.23 42.22,63.97 40.95,62.7 40.95,60.79 39.67,59.52 39.26,59.52 MODE3.A
  Bottom 0.254: U1.24 50.4,55.63 50.41,55.63
  Bottom 0.305: v42.22,65.23 42.85,64.6 46.67,64.6 51.56,59.71 51.56,56.79 50.41,55.63
LED_MODE_4  (via drill 0.35)
  Top 0.305: v48.56,61.42 46.88,59.74 MODE4.A
  Bottom 0.254: U1.23 50.26,56.13
  Bottom 0.305: 50.26,56.13 51.1,56.98 51.1,59.52 49.2,61.42 v48.56,61.42
LED_MONITOR_1  (via drill 0.35)
  Top 0.305: v25.07,46.19 25.28,45.98 MON1.A
  Bottom 0.254: 32.31,52.59 32.34,52.63 U1.51
  Bottom 0.305: 32.31,52.59 25.52,45.8 25.45,45.8 v25.07,46.19
LED_MONITOR_2  (via drill 0.35)
  Top 0.305: v32.69,44.91 MON2.A
  Bottom 0.254: 37.44,46.19 37.71,46.19 39.33,47.8 U1.45
  Bottom 0.305: v32.69,44.91 33.96,46.19 37.44,46.19
LED_MONITOR_3  (via drill 0.35)
  Top 0.305: v37.77,45.55 38.41,45.55 39.04,46.19 MON3.A
  Bottom 0.305: v37.77,45.55 38.76,46.54 38.76,46.56 39.83,47.63 U1.44
LED_MONITOR_4  (via drill 0.35)
  Top 0.305: v44.76,43.69 45.39,44.33 MON4.A
  Bottom 0.254: U1.36 43.83,45.19 43.92,45.1
  Bottom 0.305: v44.76,43.69 44.76,44.27 43.92,45.1
LED_STATUS_1  (via drill 0.35)
  Top 0.305: v26.34,70.95 STAT1.A
  Bottom 0.254: U1.27 50.84,54.13 50.89,54.18
  Bottom 0.305: 50.89,54.18 52.93,56.22 52.93,60.28 47.24,65.97 44.64,65.97 40.65,69.96 26.34,69.96 v26.34,70.95
LED_STATUS_2  (via drill 0.35)
  Top 0.305: v32.69,70.95 STAT2.A
  Bottom 0.254: U1.28 50.99,53.63 51.04,53.68
  Bottom 0.305: 51.04,53.68 53.39,56.03 53.39,60.47 47.43,66.43 44.83,66.43 40.84,70.42 33.22,70.42 v32.69,70.95
LED_USER_ANODE
  Top 0.305: T1.C R1.3 R1.4 R1.5 R1.6 R1.7 R1.8
MUTE_HF_AMP  (via drill 0.35)
  Top 0.305: v39.67,57.11 39.6,57.19 34.1,57.19 33.21,58.07 24.36,58.07 19.05,63.38 19.05,73.59 24.33,78.88 v26.9,78.88
  Bottom 0.254: U1.8 41.38,60.98 41.38,58.81 v39.67,57.11
  Bottom 0.305: v26.9,78.88 26.9,80.01 R22.2
MUTE_MF_AMP  (via drill 0.35)
  Top 0.254: 13.64,56.34 15.65,54.34 24.13,54.34 26.19,52.28 26.19,52.24 26.21,52.21
  Top 0.305: 26.21,52.21 v27.76,50.66 | v18.47,79.2 14.91,79.2 13.64,77.94 13.64,56.34
  Bottom 0.305: U1.54 35.89,54.09 31.86,54.09 28.4,50.63 27.61,50.63 27.64,50.66 v27.76,50.66 | v18.47,79.2 19.32,80.06 R27.2
N$1
  Top 0.305: STAT1.C 29.1,77.3 37.13,77.3 42.22,72.22 58.09,72.22 63.8,66.5 R1.9
N$2
  Top 0.305: STAT2.C 34.07,75.92 37.87,75.92 42.03,71.76 57.9,71.76 64.43,65.23 R1.10
N$3
  Top 0.305: R1.11 65.05,63.97 57.76,71.26 33.96,71.26 32.97,70.27 30.09,70.27 25.89,66.06 25.89,63.78 26.34,63.33 MODE1.C
N$4
  Top 0.305: R1.12 65.08,62.7 64.42,63.35 64.42,63.95 57.57,70.8 34.15,70.8 33.16,69.81 31.55,69.81 29.72,67.98 29.72,67.97 29.32,67.57 28.68,67.57 26.99,65.87 26.99,63.98 29.12,61.84 MODE2.C
N$5
  Top 0.305: MODE3.C 39.04,63.33 46.05,70.34 57.38,70.34 63.8,63.92 63.8,62.06 64.44,61.42 R1.13
N$6
  Top 0.305: MODE4.C 52.59,69.05 54.91,69.05 63.8,60.16 R1.14
N$7
  Top 0.254: 32.04,54.77 35.48,54.77 35.78,55.08 37.08,55.08 59.99,55.08
  Top 0.305: R1.15 63.8,58.89 59.99,55.08 | 32.04,54.77 29.39,52.12 29.39,49.99 28.37,48.98 26.5,48.98 MON1.C
N$8
  Top 0.254: 32.69,53.17 33.89,54.37 35.79,54.37 35.86,54.44 60.63,54.44
  Top 0.305: MON2.C 32.69,53.17 | R1.16 63.8,57.62 60.63,54.44
N$9
  Top 0.305: MON3.C 39.04,50.63 42.22,53.8 61.27,53.8 63.8,51.27 R2.9
N$10
  Top 0.305: R2.10 63.8,49.99 60.63,53.17 58.09,53.17 54.91,49.99 46.24,49.99 MON4.C
N$11
  Top 0.305: FAULT1.C 26.34,40.47 55.55,40.47 63.8,48.73 R2.11
N$12
  Top 0.305: FAULT2.C 36.09,39.84 56.19,39.84 63.8,47.45 R2.12
N$13
  Top 0.305: FAULT3.C 41.8,39.2 56.82,39.2 63.8,46.19 R2.13
N$14
  Top 0.305: FAULT4.C 47.52,38.56 57.45,38.56 63.8,44.91 R2.14
N$15
  Top 0.305: FAULT5.C 53.23,37.93 54.15,37.93 58.09,37.93 63.8,43.65 R2.15
N$16
  Top 0.305: FAULT6.C 64.03,42.38 R2.16
N$17
  Top 0.305: T1.B 77.61,57.37 R3.2
N$18  (via drill 0.35)
  Top 0.254: v27.86,87.46 25.89,87.46 24.09,89.26 12.65,89.26 7.29,83.9 7.29,70.95 HF_AMP.3
  Bottom 0.254: T4.C 29.66,87.46 v27.86,87.46
N$19
  Bottom 0.254: T4.B 30.67,83.65 R19.1 30.49,81.8 R20.1
N$20  (via drill 0.35)
  Top 0.254: v25.07,87.46 22.08,87.46 20.69,88.85 13.13,88.85 7.92,83.65 7.92,66.5 HF_AMP.1
  Bottom 0.254: T9.C 26.13,87.46 v25.07,87.46
N$21
  Bottom 0.254: T9.B 27.14,83.62 R21.1 26.99,81.82 R22.1
N$22  (via drill 0.35)
  Top 0.254: v14.28,87.46 9.83,83.02 9.83,49.36 9.19,48.73 8.05,48.73 | 8.05,48.73 LF_AMP.3 | v7.8,37.42 7.8,38.69 8.56,39.45 8.56,48.22 8.05,48.73
  Bottom 0.254: T7.C 14.37,87.37 v14.28,87.46 | R31.1 7.8,36.55 v7.8,37.42
N$23  (via drill 0.35)
  Top 0.254: v21.26,87.46 18.27,87.46 17.28,88.45 13.61,88.45 8.56,83.4 8.56,61.42 6.66,59.52 MF_AMP.3
  Bottom 0.254: T5.C v21.26,87.46
N$24
  Bottom 0.254: T5.B 23.45,83.5 R24.1 23.39,83.41 R25.1
N$25
  Top 0.305: T2.C 66.98,76.5 68.72,74.76 72.28,74.76 R9.2 73.55,82.8 FAN.1
N$26
  Top 0.305: R8.1 64.76,71.69 T2.B
N$27  (via drill 0.35)
  Top 0.254: v17.45,87.46 15.1,87.46 14.52,88.04 14.03,88.04 9.19,83.2 9.19,55.71 7.92,54.44 MF_AMP.1
  Bottom 0.254: T6.C 17.49,87.42 v17.45,87.46
N$28
  Bottom 0.254: T6.B 19.87,83.62 R26.1 19.72,81.85 R27.1
N$29
  Bottom 0.254: T7.B 16.32,83.32 R23.1 16.29,81.64 R28.1
N$30
  Top 0.305: RCA.1A 65.08,17.61
  Top 0.813: X1.1 61.27,16.34 62.53,17.61 RCA.1A | 65.08,17.61 66.98,15.7 72.77,15.7 RCA.1B
N$31
  Top 0.813: X1.2 58.73,18.25 62.53,22.06 66.67,22.06 RCA.2
N$32
  Bottom 0.508: JP2.3 86.66,9.36 79.68,9.36 X2.1
N$33
  Top 0.508: JP2.2 83.49,3.64 75.87,3.64 73.97,5.55 X2.2
N$34
  Top 0.508: JP2.1 81.59,9.36 72.69,9.36 71.42,8.08 X2.3
N$35
  Bottom 0.254: T8.3 6.66,33.7 R31.2
N$36
  Top 0.711: USB.1 51.74,15.7 51.74,10.62 53.65,8.72 X3.1
N$37
  Bottom 0.711: USB.2 46.7,18.92 47.93,20.15 50.47,20.15 51.1,19.52 X3.2
N$38
  Top 0.711: USB.3 46.7,12.49 48.56,10.62 X3.3
N$39
  Top 0.711: USB.4 47.91,16.34 45.39,16.34 44.76,15.7 44.76,10.62 46.02,9.36 X3.4
N$40
  Top 0.305: 41.93,15.36 USB.SH1
  Top 0.711: X3.5 43.48,13.8 41.93,15.36
  Top 1.27: USB.SH1 41.93,19.23 44.76,22.06 51.74,22.06 53.97,19.83 USB.SH2
N$41
  Bottom 0.254: D1.A 4.04,35.33 R30.1
N$42
  Bottom 0.254: U1.30 48.46,52.63 48.47,52.63
  Bottom 0.305: C3.1 49.7,51.4 48.47,52.63
N$43
  Bottom 0.254: U1.50 32.5,52.13 32.49,52.13
  Bottom 0.305: 32.49,52.13 22.1,41.74 DB1.1
N$45
  Bottom 0.254: U1.60 29.56,57.13 29.53,57.16
  Bottom 0.305: R11.1 22.53,49.36 23.17,49.99 25.45,49.99 26.09,50.63 26.09,51.39 26.85,52.15 26.85,54.54 27.1,54.8 27.17,54.8 29.53,57.16
N$46  (via drill 0.35)
  Top 0.305: v43.02,69.85 43.02,68.58 v39.04,64.6
  Bottom 0.254: v39.04,64.6 40.83,62.81 U1.7
  Bottom 0.305: v43.02,69.85 43.02,73.95 NRST.1
N$47
  Bottom 0.305: IC1.4 63.06,61.74 R12.1
N$50  (via drill 0.35)
  Top 0.305: v56.82,65.87 55.55,64.6 v52.38,64.6
  Bottom 0.305: R13.1 62.12,67.78 58.73,67.78 v56.82,65.87 | v52.38,64.6 50.09,66.89 45.02,66.89 41.03,70.87 41.02,70.87 33.96,77.94 X4.1
N$52
  Bottom 0.305: LF_AMP.2 7.92,46.19 9.19,44.91 9.19,42.38 9.83,41.74 R14.1
N$54
  Bottom 0.305: MF_AMP.2 8.56,56.98 9.19,56.34 9.19,55.08 9.83,54.44 R15.1
N$58
  Bottom 0.305: HF_AMP.2 R16.1
RCC_OSC_IN
  Bottom 0.254: U1.5 39.81,61.05 39.81,61.88 37.76,63.93 37.76,63.97
  Bottom 0.305: 37.76,63.97 32.18,63.97 Q1.1 30.04,64.36 C12.1
RCC_OSC_OUT
  Bottom 0.254: 37.95,64.42 40.33,62.04 U1.6
  Bottom 0.305: 37.95,64.42 36.55,64.42 Q1.2 38.07,65.23 38.76,65.92 39.39,65.92 C4.1
SOFTCLIP_LF_AMP  (via drill 0.35)
  Top 0.254: 28.52,51.02 24.45,55.09 22.16,55.09 v22.02,54.95 | v21.77,52.92 17.7,48.85 17.7,43.26 v16.18,41.74
  Top 0.305: 28.52,51.02 28.52,50.45 28.12,50.05 27.95,50.05 v27.6,49.7
  Bottom 0.254: 32.01,53.59 32.05,53.63 U1.53 | v22.02,54.95 21.77,54.69 v21.77,52.92 | v16.18,41.74 15.16,40.72 8.94,40.72 LF_AMP.1 6.2,43.47 R29.1 4.15,40.63 D1.C
  Bottom 0.305: 32.01,53.59 28.08,49.66 27.57,49.66 27.36,49.87 27.43,49.87 v27.6,49.7
ST_VDD
  Top 0.305: R10.1 26.76,13.17 28.25,13.17 PROG.1
STANDBY_HF_AMP  (via drill 0.35)
  Top 0.305: v40.82,57.11 40.64,57.11 39.96,57.79 39.39,57.79 39.3,57.69 34.23,57.69 33.4,58.53 25.3,58.53 19.61,64.22 19.61,73.5 23.73,77.63 v25.98,77.63
  Bottom 0.254: U1.9 41.83,59.44 41.81,59.42 41.81,58.99 41.81,58.1 v40.82,57.11
  Bottom 0.305: R20.2 28.05,77.63 v25.98,77.63
STANDBY_LF_AMP  (via drill 0.35)
  Top 0.254: v15.04,80.18 14.69,79.84 13.64,79.84 13,79.2 13,56.37 15.44,53.93 23.93,53.93 25.75,52.11
  Top 0.305: v25.07,47.33 25.07,50.3 25.75,50.98 25.75,52.11
  Bottom 0.254: U1.52 32.21,53.13 32.2,53.13 | R28.2 15.29,79.93 v15.04,80.18
  Bottom 0.305: 32.2,53.13 25.8,46.73 25.67,46.73 v25.07,47.33
STANDBY_LF_AMP_MONITOR  (via drill 0.35)
  Top 0.254: v39.04,53.8 39.04,52.53 34.59,48.09 34.59,44.28 33.86,43.55 v27.33,43.55 | v24.31,40.72 24.31,29.29 v24.05,29.04
  Bottom 0.254: U1.57 37.22,55.63 v39.04,53.8 | T8.1 8.99,29.04 v24.05,29.04 | v24.31,40.72 27.1,43.52 27.36,43.52 v27.33,43.55
STANDBY_MF_AMP  (via drill 0.35)
  Top 0.254: v39.67,55.71 34.8,55.71 34.46,55.37 33.98,55.37 33.64,55.71 14.91,55.71 14.28,56.34 14.28,77.94 14.91,78.57 v21.89,78.57
  Bottom 0.254: U1.20 47.16,57.56 46.66,57.56 43.55,54.44 40.95,54.44 v39.67,55.71 | v21.89,78.57 23.31,79.98 R25.2
SWCLK  (via drill 0.35)
  Top 0.305: v23.17,39.84 v23.17,18.25
  Bottom 0.254: 32.64,51.63 U1.49
  Bottom 0.305: PROG.3 32.06,13.17 30.78,11.89 26.34,11.89 23.17,15.07 v23.17,18.25 | 32.64,51.63 23.17,42.16 v23.17,39.84
SWDIO  (via drill 0.35)
  Top 0.254: v26.97,29.67 26.97,22.69 30.15,19.52 33.33,19.52 34.59,18.25 PROG.6
  Bottom 0.152: 38.88,50.01 U1.46
  Bottom 0.254: v26.97,29.67 25.07,31.58 25.07,40.47 30.15,45.55 32.39,45.55 33.5,46.65 37.29,46.65 37.31,46.66 37.62,46.66 38.88,47.93 38.88,50.01
SWO  (via drill 0.35)
  Top 0.254: v20.65,36.66 20.65,21.4 v21.89,20.15
  Bottom 0.254: 26.18,49.03 24.11,49.03 23.77,48.69 23.77,45.58 22.95,44.76 20.47,44.76 19.99,44.28 19.99,38.59 20.26,38.59 20.65,38.2 20.65,37.66 20.62,37.63 20.62,36.66 v20.65,36.66 | v21.89,20.15 27.61,20.15 29.52,18.25 PROG.2 | 27.16,51.02 30.77,54.63 U1.55
  Bottom 0.305: 26.18,49.03 26.9,49.75 26.9,50.06 27.16,50.32 27.16,51.02
THERM1_ANALOG_INPUT  (via drill 0.35)
  Top 0.305: v44.12,62.06 44.12,62.36 43.44,63.05 43.44,63.94 46.02,66.53 v46.02,69.05 | THERM1.2 43.91,82.59 R4.1
  Bottom 0.254: U1.14 44.33,61.85 v44.12,62.06
  Bottom 0.305: v46.02,69.05 46.02,73.49 42.85,76.66 42.85,78.44 | 42.85,78.44 42.85,82.38 THERM1.2 | C13.1 43.26,78.04 42.85,78.44
THERM2_ANALOG_INPUT  (via drill 0.35)
  Top 0.305: v47.93,69.05 47.93,68.41 46.66,67.14 46.66,66.52 44.12,63.98 v44.12,63.33 | THERM2.2 50.26,82.59 R5.1
  Bottom 0.254: U1.15 44.83,62.62 v44.12,63.33
  Bottom 0.305: v47.93,69.05 49.19,69.05 49.84,69.69 49.84,75.39 49.2,76.03 49.2,78.93 | THERM2.2 49.2,82.38 49.2,78.93 | C14.1 49.99,78.14 49.2,78.93
THERM3_ANALOG_INPUT  (via drill 0.35)
  Top 0.305: v45.39,63.33 45.39,63.97 v50.47,69.05 | THERM3.2 56.6,82.59 R6.1
  Bottom 0.254: U1.16 45.33,63.27 v45.38,63.32
  Bottom 0.305: v45.38,63.32 v45.39,63.33 | THERM3.2 56.19,82.38 54.91,81.11 54.91,79.26 | v50.47,69.05 52.38,69.05 54.91,71.59 54.91,79.26 | 54.91,79.26 56.31,77.86 C15.1
USER_LED_PWM  (via drill 0.35)
  Top 0.305: v63.8,55.08 77.36,55.08 R3.1
  Bottom 0.254: 51.18,53.18 51.13,53.13 U1.29
  Bottom 0.305: 51.18,53.18 53.08,55.08 v63.8,55.08
VDD  (via drill 0.35)
  Top 0.254: v19.4,45.8 21.26,45.8
  Top 0.305: 21.26,45.55 21.26,45.8 | 59.36,46.82 59.68,46.5 | v54.28,61.42 54.28,63.33 | 24.19,68.29 25.05,69.15 25.05,75.45 27.41,77.81 42.14,77.81 42.22,77.73
  Top 0.406: 24.69,42.12 25.07,42.12 | v41.83,55.84 41.68,55.99 41.68,57.9 41.07,58.5 v38.79,58.5
  Top 0.508: v42.22,88.09 42.22,77.73 42.22,77.3 43.48,76.03 44.76,76.03 45.6,76.88 R4.2 | R5.2 51.95,76.88 51.1,76.03 49.2,76.03 47.93,77.3 v47.93,88.09 | R6.2 58.3,76.88 57.45,76.03 55.55,76.03 54.28,77.3 v54.28,88.09 | R7.2 71.64,80.06 v72.06,80.47 | v22.53,66.63 24.19,68.29
  Top 0.61: 21.26,45.55 24.69,42.12 24.83,42.12 27.01,44.31 27.26,44.31 v31.04,48.09 | 21.26,45.8 21.26,49.99 22.53,51.27 v25.07,51.27 | 25.07,42.12 R10.2
  Top 0.813: v53.65,46.82 59.36,46.82 | v60.63,58.25 60.63,60.79 58.09,63.33 54.28,63.33 53.01,63.33 v49.02,59.34 47.3,57.62 v43.74,57.62 | v88.57,77.3 v88.57,50.76
  Top 1.27: v61.27,48.09 59.68,46.5 55.42,42.25 25.2,42.25 25.07,42.12
  Bottom 0.254: R18.1 20.41,46.6 19.48,45.68 19.4,45.68 v19.4,45.8 | 22.44,66.54 v22.53,66.63 | 37.95,59.3 38.11,59.13 38.54,59.13 38.79,58.89 | 37.12,49.36 37.49,49.73 U1.48 | U1.19 48.45,58.13 48.56,58.25 48.56,58.66 48.45,58.77 | U1.13 43.83,57.71 v43.74,57.62 | U1.1 37.9,60.96 37.9,60.46 37.95,60.42 37.95,59.3 | 37.95,59.3 37.78,59.13 U1.64 35.93,59.7 C5.1 | 48.56,58.89 v49.02,59.34 | 47.3,50.71 47.3,51.56 U1.32 | 60.63,48.73 60.6,48.75
  Bottom 0.305: 37.12,49.36 36.5,49.36 36.1,49.76 C6.1 | v25.07,51.27 25.13,51.33 | C7.1 47.3,47.45 | 48.45,58.77 48.56,58.89 | v60.63,58.25 60.63,59.81 IC1.5 60.98,60.16 C9.1 | C8.1 v54.28,61.42 | 22.9,51.27 C10.1 | v38.79,58.5 38.79,58.89
  Bottom 0.406: 36.5,49.36 32.31,49.36 | v43.74,57.62 41.96,55.84 v41.83,55.84
  Bottom 0.508: v72.06,80.47 77.78,80.47 80.31,77.94 87.94,77.94 | R17.1 22.44,66.54
  Bottom 0.61: 25.13,51.33 U2.8 | v25.07,51.27 22.9,51.27 | v61.27,48.09 60.63,48.73 | 32.31,49.36 v31.04,48.09 | 60.6,48.75 C11.1
  Bottom 0.813: C2.+ v88.57,50.76 | v42.22,88.09 v47.93,88.09 v54.28,88.09 77.78,88.09 87.94,77.94 v88.57,77.3 | 47.3,50.71 47.3,47.45 48.56,46.19 53.01,46.19 v53.65,46.82 | v60.63,58.25 69.52,58.25 73.01,54.76 73.01,52.22
  Bottom 1.27: IC2.2 84.78,40.45 83.49,41.74 83.49,43.65 86.54,46.69 C2.+ 86.54,55.2 84.12,57.62 78.41,57.62 73.01,52.22 68.89,48.09 v61.27,48.09

### Text on the board
tNames: IRK | IRA | T1 | T2 | T3 | GND | +5V | PWM_IN | PWM_OUT | FAN | HFS | GND | HFM | MFS | GND | MFM | GND | LFS | LFS | +5V | +5V | GND | LFC | LFC | I2S | DO | DI | DI | B | W | W | M | M | JTRST | JTRST | SWDIO | SWDIO | SWO | VDD | SWCLK | GND | OPT3 | OPT2 | OPT2 | OPT1 | OPT1 | OPT3 | OPT3 | OPT2 | OPT1 | S | POS | GND
bNames: IRK | IRA | T1 | T2 | T3 | GND | +5V | PIN | POUT | NRST | S | G | M | S | G | M | GND | S | G | +5V | C | I2S | DO | DI | B | W | M | JTRST | SWDIO | SWO | VDD | SWCLK | GND | OPT3 | OPT2 | OPT1 | 3 | 2 | 1 | + | _